# EAGLE design freesoc2_shield (EAGLE 7.5.0)
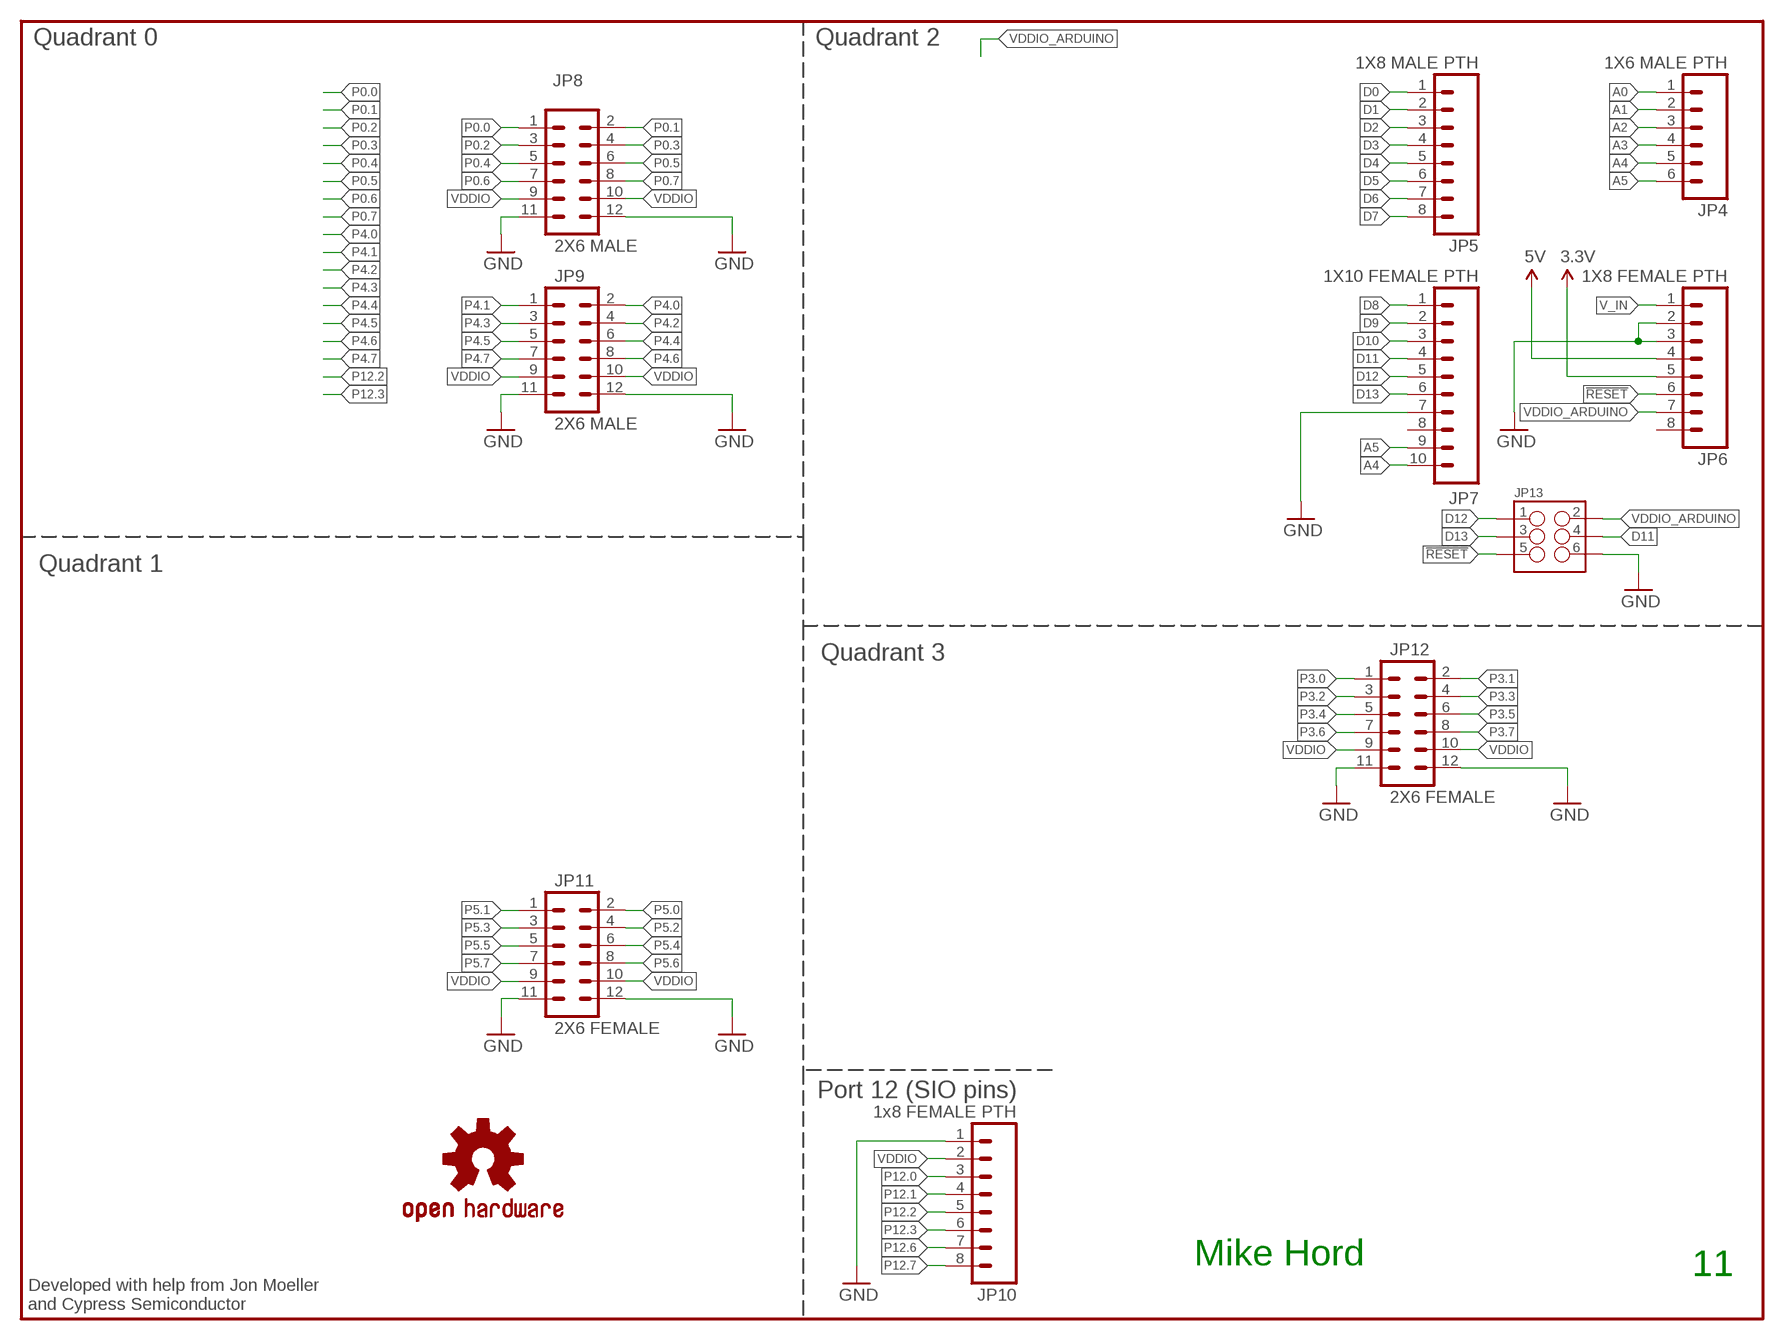
[diagram p0: schematic, sheet 1]

## Parts
FRAME1  FRAME-LETTERNO_PACKAGE  [DUMMY]
JP4  1X6 MALE PTH  M06SIP_LOCK  [1X06-SIP_LOCK]
JP5  1X8 MALE PTH  M08LOCK  [1X08_LOCK]
JP6  1X8 FEMALE PTH  M08LOCK  [1X08_LOCK]
JP7  1X10 FEMALE PTH  M10LOCK  [1X10_LOCK]
JP8  2X6 MALE  M06X2PTH_FEMALE  [2X6]
JP9  2X6 MALE  M06X2PTH_FEMALE  [2X6]
JP10  1x8 FEMALE PTH  M08LOCK  [1X08_LOCK]
JP11  2X6 FEMALE  M06X2PTH_FEMALE  [2X6]
JP12  2X6 FEMALE  M06X2PTH_FEMALE  [2X6]
JP13  M03X22X3_SILK_MALE_PTH  [2X3]
LOGO2  OSHW-LOGOS  [OSHW-LOGO-S]

## Nets
3.3V: JP6.5
5V: JP6.4
!RESET: JP6.6 JP13.5
A0: JP4.1
A1: JP4.2
A2: JP4.3
A3: JP4.4
A4: JP4.5 JP7.10
A5: JP4.6 JP7.9
D0: JP5.1
D1: JP5.2
D2: JP5.3
D3: JP5.4
D4: JP5.5
D5: JP5.6
D6: JP5.7
D7: JP5.8
D8: JP7.1
D9: JP7.2
D10: JP7.3
D11: JP7.4 JP13.4
D12: JP7.5 JP13.1
D13: JP7.6 JP13.3
GND: JP6.2 JP6.3 JP7.7 JP8.11 JP8.12 JP9.11 JP9.12 JP10.1 JP11.11 JP11.12 JP12.11 JP12.12 JP13.6
P0.0: JP8.1
P0.1: JP8.2
P0.2: JP8.3
P0.3: JP8.4
P0.4: JP8.5
P0.5: JP8.6
P0.6: JP8.7
P0.7: JP8.8
P3.0: JP12.1
P3.1: JP12.2
P3.2: JP12.3
P3.3: JP12.4
P3.4: JP12.5
P3.5: JP12.6
P3.6: JP12.7
P3.7: JP12.8
P4.0: JP9.2
P4.1: JP9.1
P4.2: JP9.4
P4.3: JP9.3
P4.4: JP9.6
P4.5: JP9.5
P4.6: JP9.8
P4.7: JP9.7
P5.0: JP11.2
P5.1: JP11.1
P5.2: JP11.4
P5.3: JP11.3
P5.4: JP11.6
P5.5: JP11.5
P5.6: JP11.8
P5.7: JP11.7
P12.0: JP10.3
P12.1: JP10.4
P12.2: JP10.5
P12.3: JP10.6
P12.6: JP10.7
P12.7: JP10.8
V_IN: JP6.1
VDDIO: JP8.9 JP8.10 JP9.9 JP9.10 JP10.2 JP11.9 JP11.10 JP12.9 JP12.10
VDDIO_ARDUINO [ARDUINO_VCC]: JP6.7 JP13.2
Unconnected: JP6.8 JP7.8

## Notes on the sheet
- Quadrant 0 | Quadrant 2
- Quadrant 1
- Quadrant 3
- Port 12 (SIO pins)
- Mike Hord
- 11
- Developed with help from Jon Moeller
  and Cypress Semiconductor

## Library data of the parts
FRAME1 = SparkFun-Aesthetics:FRAME-LETTER: Schematic Frame Standard 8.5x11 US Letter frame; DESIGNER: Nobody; VERSION: v01
JP4 = SparkFun-Connectors:M06: Header 6 Standard 6-pin 0.1" header. Use with straight break away headers (SKU : PRT-00116), right angle break away headers (PRT-00553), swiss pins (PRT-00743), machine pins (PRT-00117), and female headers (PRT-00115). Molex polarized connector foot print use with SKU : PRT-08094 with associated crimp pins and housings. NOTES ON THE VARIANTS LOCK and LOCK_LONGPADS... This footprint was designed to help hold the alignment of a through-hole component (i.e. 6-pin header) while soldering it into place. You may notice that each hole has been shifted either up or down by 0.005 of an inch from it's more standard position (which is a perfectly straight line). This slight alteration caused the pins (the squares in the middle) to touch the edges of the holes. Because they are alternating, it causes a "brace" to hold the component in place. 0.005 has proven to be the perfect amount of "off-center" position when using our standard breakaway headers. Although looks a little odd when you look at the bare footprint, once you have a header in there, the alteration is very hard to notice. Also,if you push a header all the way into place, it is covered up entirely on the bottom side. This idea of altering the position of holes to aid alignment will be further integrated into the Sparkfun Library for other footprints. It can help hold any component with 3 or more connection pins.; PROD_ID: CONN-08437
JP5 JP6 JP10 = SparkFun-Connectors:M08: Header 8 Standard 8-pin 0.1" header. Use with straight break away headers (SKU : PRT-00116), right angle break away headers (PRT-00553), swiss pins (PRT-00743), machine pins (PRT-00117), and female headers (PRT-00115).; PROD_ID: CONN-08438
JP7 = SparkFun-Connectors:M10: Header 10 Standard 10-pin 0.1" header. Use with straight break away headers (SKU : PRT-00116), right angle break away headers (PRT-00553), swiss pins (PRT-00743), machine pins (PRT-00117), and female headers (PRT-00115).; PROD_ID: CONN-11563
JP8 JP9 = SparkFun-Connectors:M06X2; PROD_ID: CONN-12423; VALUE: 2X6 FEMALE
JP11 JP12 = SparkFun-Connectors:M06X2; PROD_ID: CONN-12423
JP13 = SparkFun-Connectors:M03X2: 2x3 .1" header. Shrouded, with keying- CONN-10681 SMT- CONN-11415 Pogo pins- HW-11044; PROD_ID: CONN-09701
LOGO2 = SparkFun-Aesthetics:OSHW-LOGO: Open Source Hardware Logo This logo indicates the piece of hardware it is found on incorporates a OSHW license and/or adheres to the definition of open source hardware found here: http://freedomdefined.org/OSHW

## Net classes
0 signal: width 0.203 mm, drill 0.254 mm, clearance 0.152 mm
1 AVCC: width 0.508 mm, drill 0.508 mm, clearance 0.152 mm
2 ARDUINO_VCC: width 0.508 mm, drill 0.381 mm

## Board
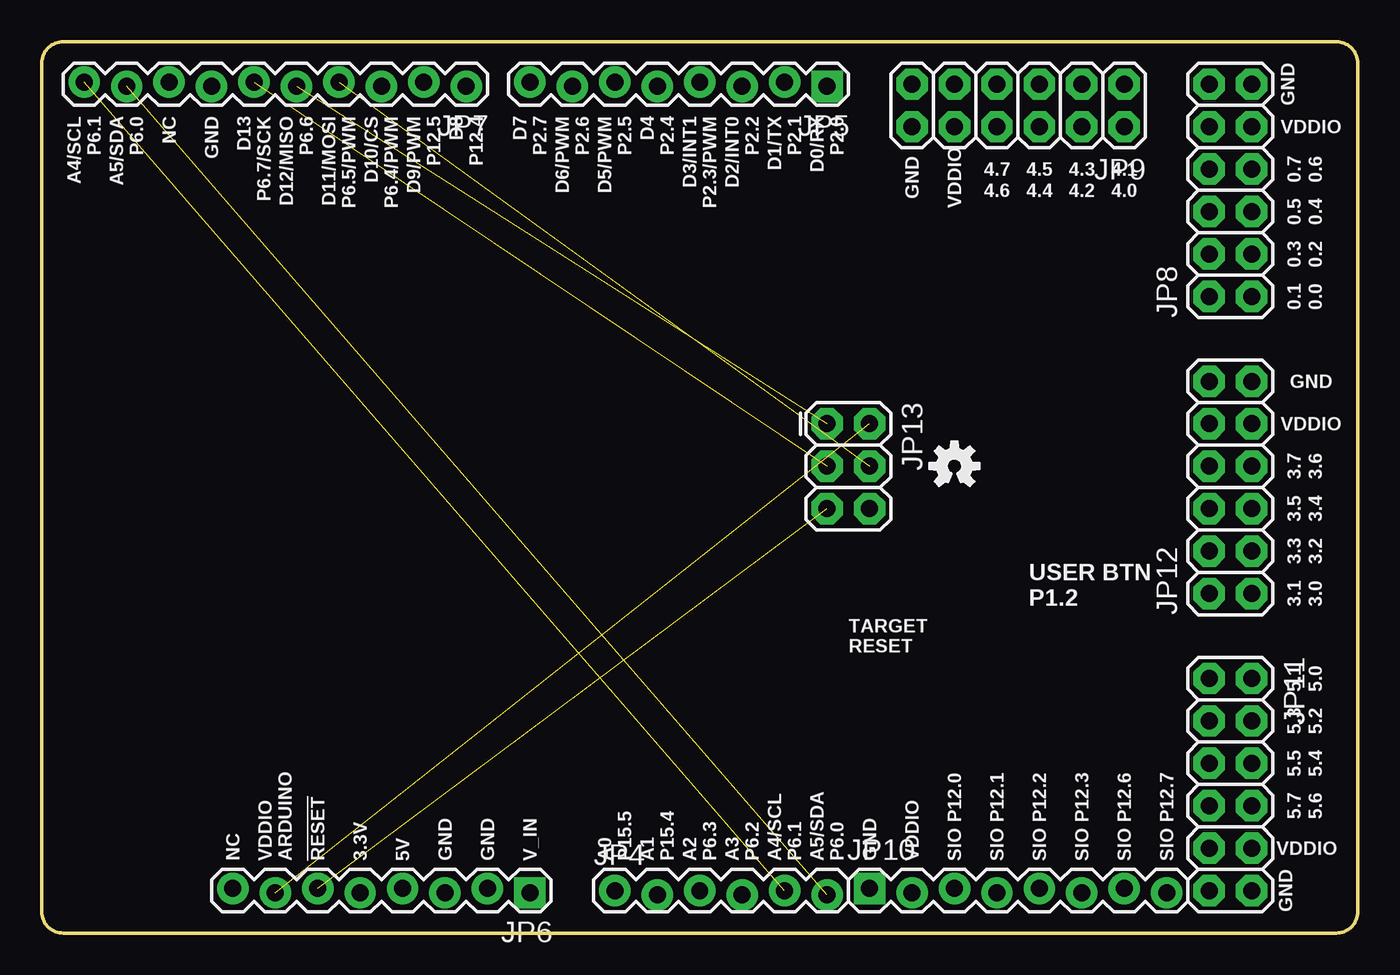
[diagram p1: board, top side]
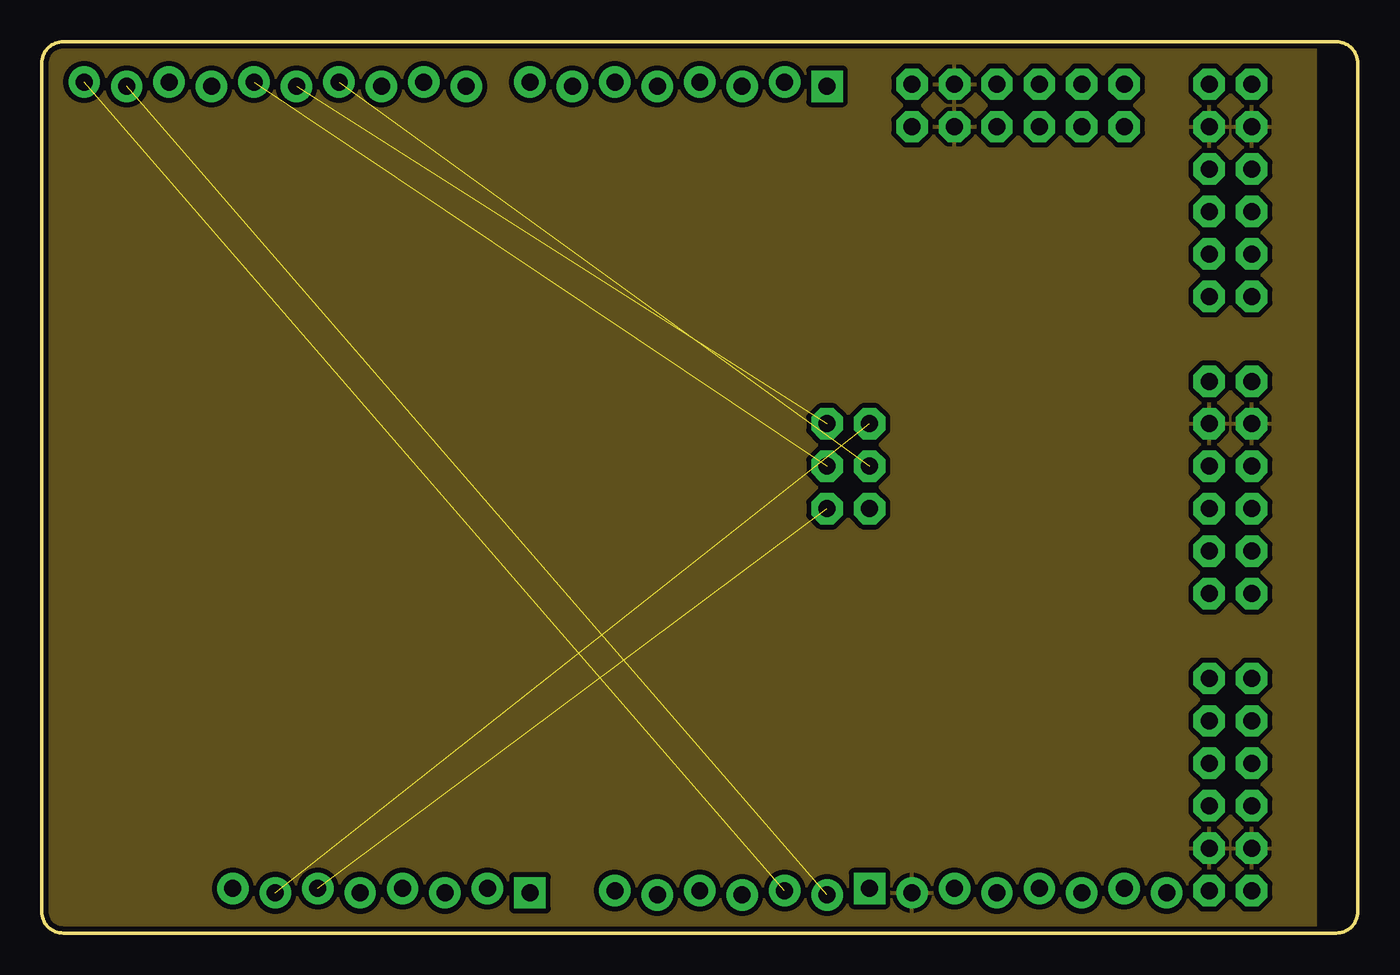
[diagram p2: board, inner layer Route2]
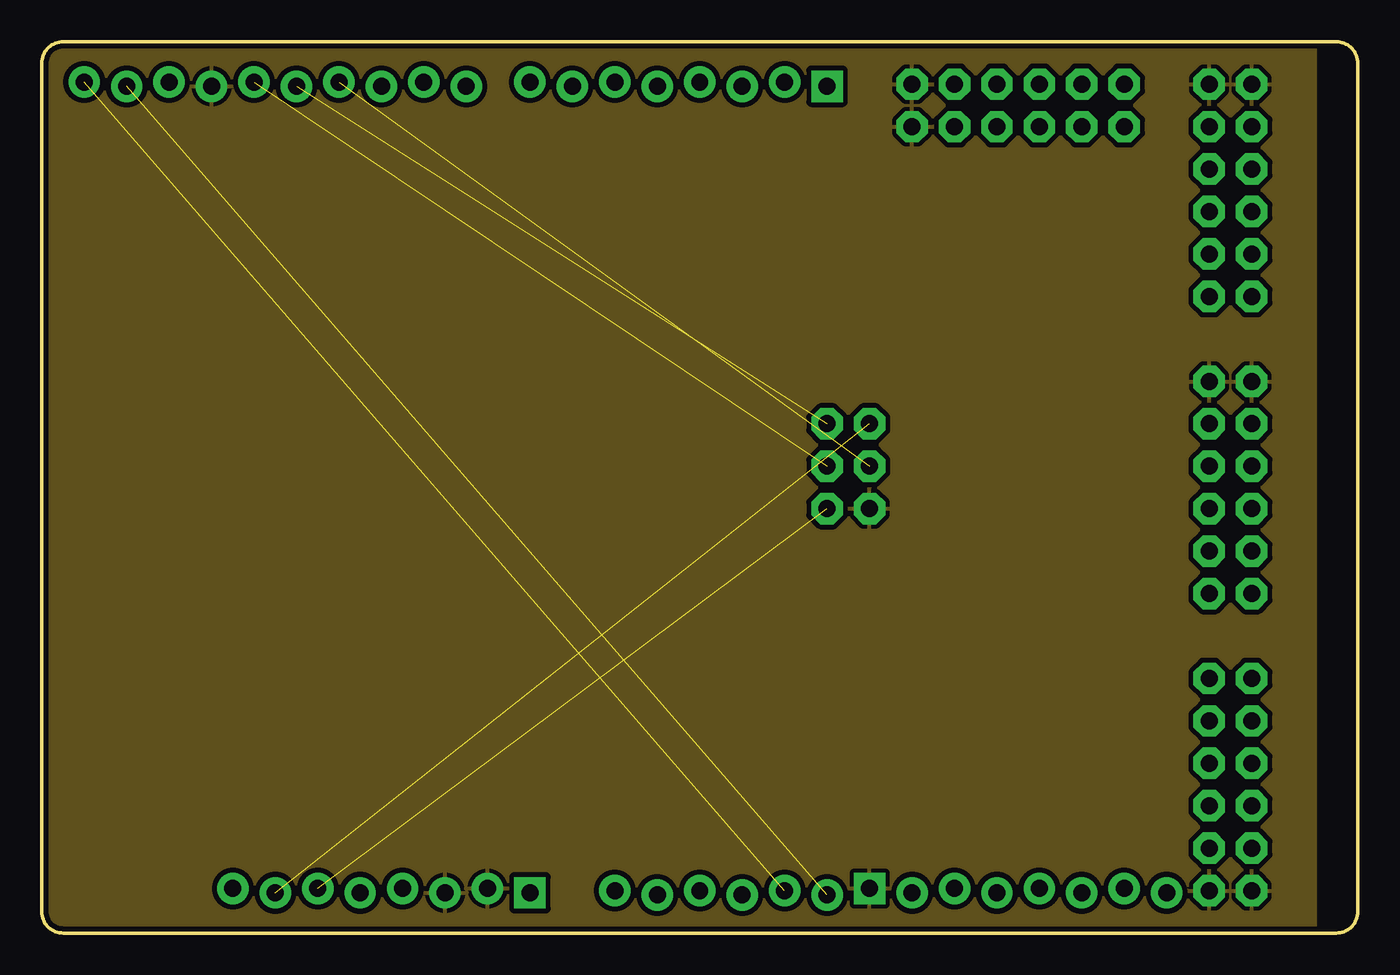
[diagram p3: board, inner layer Route15]

Size 78.74 x 53.34 mm. Coordinates in mm from the lower left corner, seen from the top.
Outline: 77.47,0 1.27,0 arc-90 0,1.27 0,52.07 arc-90 1.27,53.34 77.47,53.34 arc-90 78.74,52.07 78.74,1.27 arc-90 77.47,0
Copper layers (1*2*15*16): Top 0.035mm / dielectric 1.5mm / Route2 0.035mm / dielectric 0.15mm / Route15 0.035mm / dielectric 0.2mm / Bottom 0.035mm
Design rules "Sparkfun-x *": minimum track width 6mil, minimum drill 10mil, track to track 6mil, track to pad 6mil, pad to pad 6mil, via to via 8mil, smd to smd 6mil, copper to edge 6mil, drill to drill 8mil, minimum pad ring 12mil, minimum via ring 10mil, stop-mask expansion 4mil, vias tented up to drill 20mil, thermal gap 10mil

### Footprints (pad centres in the part's own frame; a part is rotated, then mirrored left to right if it is on the bottom)
1X06-SIP_LOCK = drill 1.016 pad 1.88: 1 0,0; 2 2.54,-0.254; 3 5.08,0; 4 7.62,-0.254; 5 10.16,0; 6 12.7,-0.254
1X08_LOCK = drill 1.016 pad 1.88 square: 1 0,0.127 | drill 1.016 pad 1.88: 2 2.54,-0.127; 3 5.08,0.127; 4 7.62,-0.127; 5 10.16,0.127; 6 12.7,-0.127; 7 15.24,0.127; 8 17.78,-0.127
1X10_LOCK = drill 1.016 pad 1.88: 1 0,0.127; 2 2.54,-0.127; 3 5.08,0.127; 4 7.62,-0.127; 5 10.16,0.127; 6 12.7,-0.127; 7 15.24,0.127; 8 17.78,-0.127; 9 20.32,0.127; 10 22.86,-0.127
2X6 = drill 1.016 pad 1.88 octagon: 1 0,0; 2 0,2.54; 3 2.54,0; 4 2.54,2.54; 5 5.08,0; 6 5.08,2.54; 7 7.62,0; 8 7.62,2.54; 9 10.16,0; 10 10.16,2.54; 11 12.7,0; 12 12.7,2.54
2X3 = drill 1.016 pad 1.88 octagon: 1 0,0; 2 0,2.54; 3 2.54,0; 4 2.54,2.54; 5 5.08,0; 6 5.08,2.54

### Placement (x,y rotation side)
FRAME1  -50.8,-16.51 0 top  (outside the outline)
JP4  34.29,2.54 0 top
JP5  46.99,50.8 180 top
JP6  29.21,2.54 180 top
JP7  25.4,50.8 180 top
JP8  72.39,38.1 90 top
JP9  64.77,50.8 180 top
JP10  49.53,2.54 0 top
JP11  69.85,15.24 270 top
JP12  72.39,20.32 90 top
JP13  46.99,30.48 270 top
LOGO2  54.61,27.94 0 top

### Tracks (layer width: path | path; a pad name or v marks a point on that pad's centre or on a via)
!RESET  (1 unrouted)
A4  (1 unrouted)
A5  (1 unrouted)
D11  (1 unrouted)
D12  (1 unrouted)
D13  (1 unrouted)
GND
  pour Route15 (isolate 0.305): 0,53.34 76.2,53.34 76.2,0 0,0
VDDIO
  pour Route2 (isolate 0.305): 0,53.34 76.2,53.34 76.2,0 0,0
VDDIO_ARDUINO  (1 unrouted)

### Text on the board
tPlace: GND | A4/SCL / P6.1 | A5/SDA / P6.0 | NC | GND | D13 / P6.7/SCK | D12/MISO / P6.6 | D11/MOSI / P6.5/PWM | D10/CS / P6.4/PWM | D9/PWM / P12.5 | D8 / P12.4 | D7 / P2.7 | D6/PWM / P2.6 | D5/PWM / P2.5 | D4 / P2.4 | D3/INT1 / P2.3/PWM | D2/INT0 / P2.2 | D1/TX / P2.1 | D0/RX / P2.0 | VDDIO | 4.7 | 4.5 | 4.3 | 4.1 | 0.7 | 0.6 | GND | VDDIO | 4.6 | 4.4 | 4.2 | 4.0 | 0.5 | 0.4 | 0.3 | 0.2 | 0.1 | 0.0 | GND | VDDIO | 3.7 | 3.6 | 3.5 | 3.4 | 3.3 | 3.2 | USER BTN / P1.2 | 3.1 | 3.0 | TARGET / RESET | 5.1 | 5.0 | 5.3 | 5.2 | 5.5 | 5.4 | 5.7 | 5.6 | VDDIO | NC | VDDIO / ARDUINO | !RESET | 3.3V | 5V | GND | GND | V_IN | A0 / P15.5 | A1 / P15.4 | A2 / P6.3 | A3 / P6.2 | A4/SCL / P6.1 | A5/SDA / P6.0 | GND | VDDIO | SIO P12.0 | SIO P12.1 | SIO P12.2 | SIO P12.3 | SIO P12.6 | SIO P12.7 | GND
Measures: Measurement units given in inches